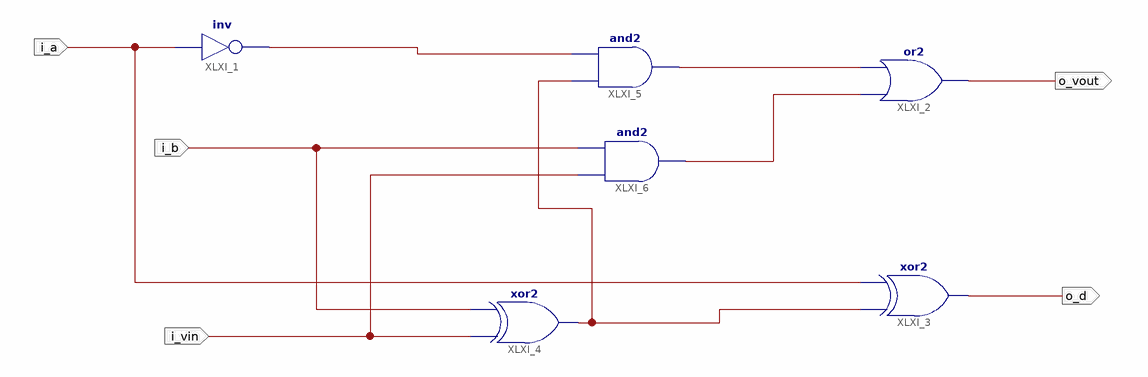
[diagram p0: schematic sheet 1]
// Xilinx ISE schematic Laby5.sch (spartan3e) as structural Verilog: 6 symbols, 5 ports
module Laby5 (
  input  i_vin,
  input  i_b,
  input  i_a,
  output o_vout,
  output o_d
);

  wire XLXN_4, XLXN_5, XLXN_13, XLXN_14;

  not XLXI_1 (XLXN_13, i_a);
  or XLXI_2 (o_vout, XLXN_5, XLXN_4);
  xor XLXI_3 (o_d, XLXN_14, i_a);
  xor XLXI_4 (XLXN_14, i_vin, i_b);
  and XLXI_5 (XLXN_4, XLXN_14, XLXN_13);
  and XLXI_6 (XLXN_5, i_vin, i_b);
endmodule
